# EAGLE design distribution (EAGLE 6.6.0)
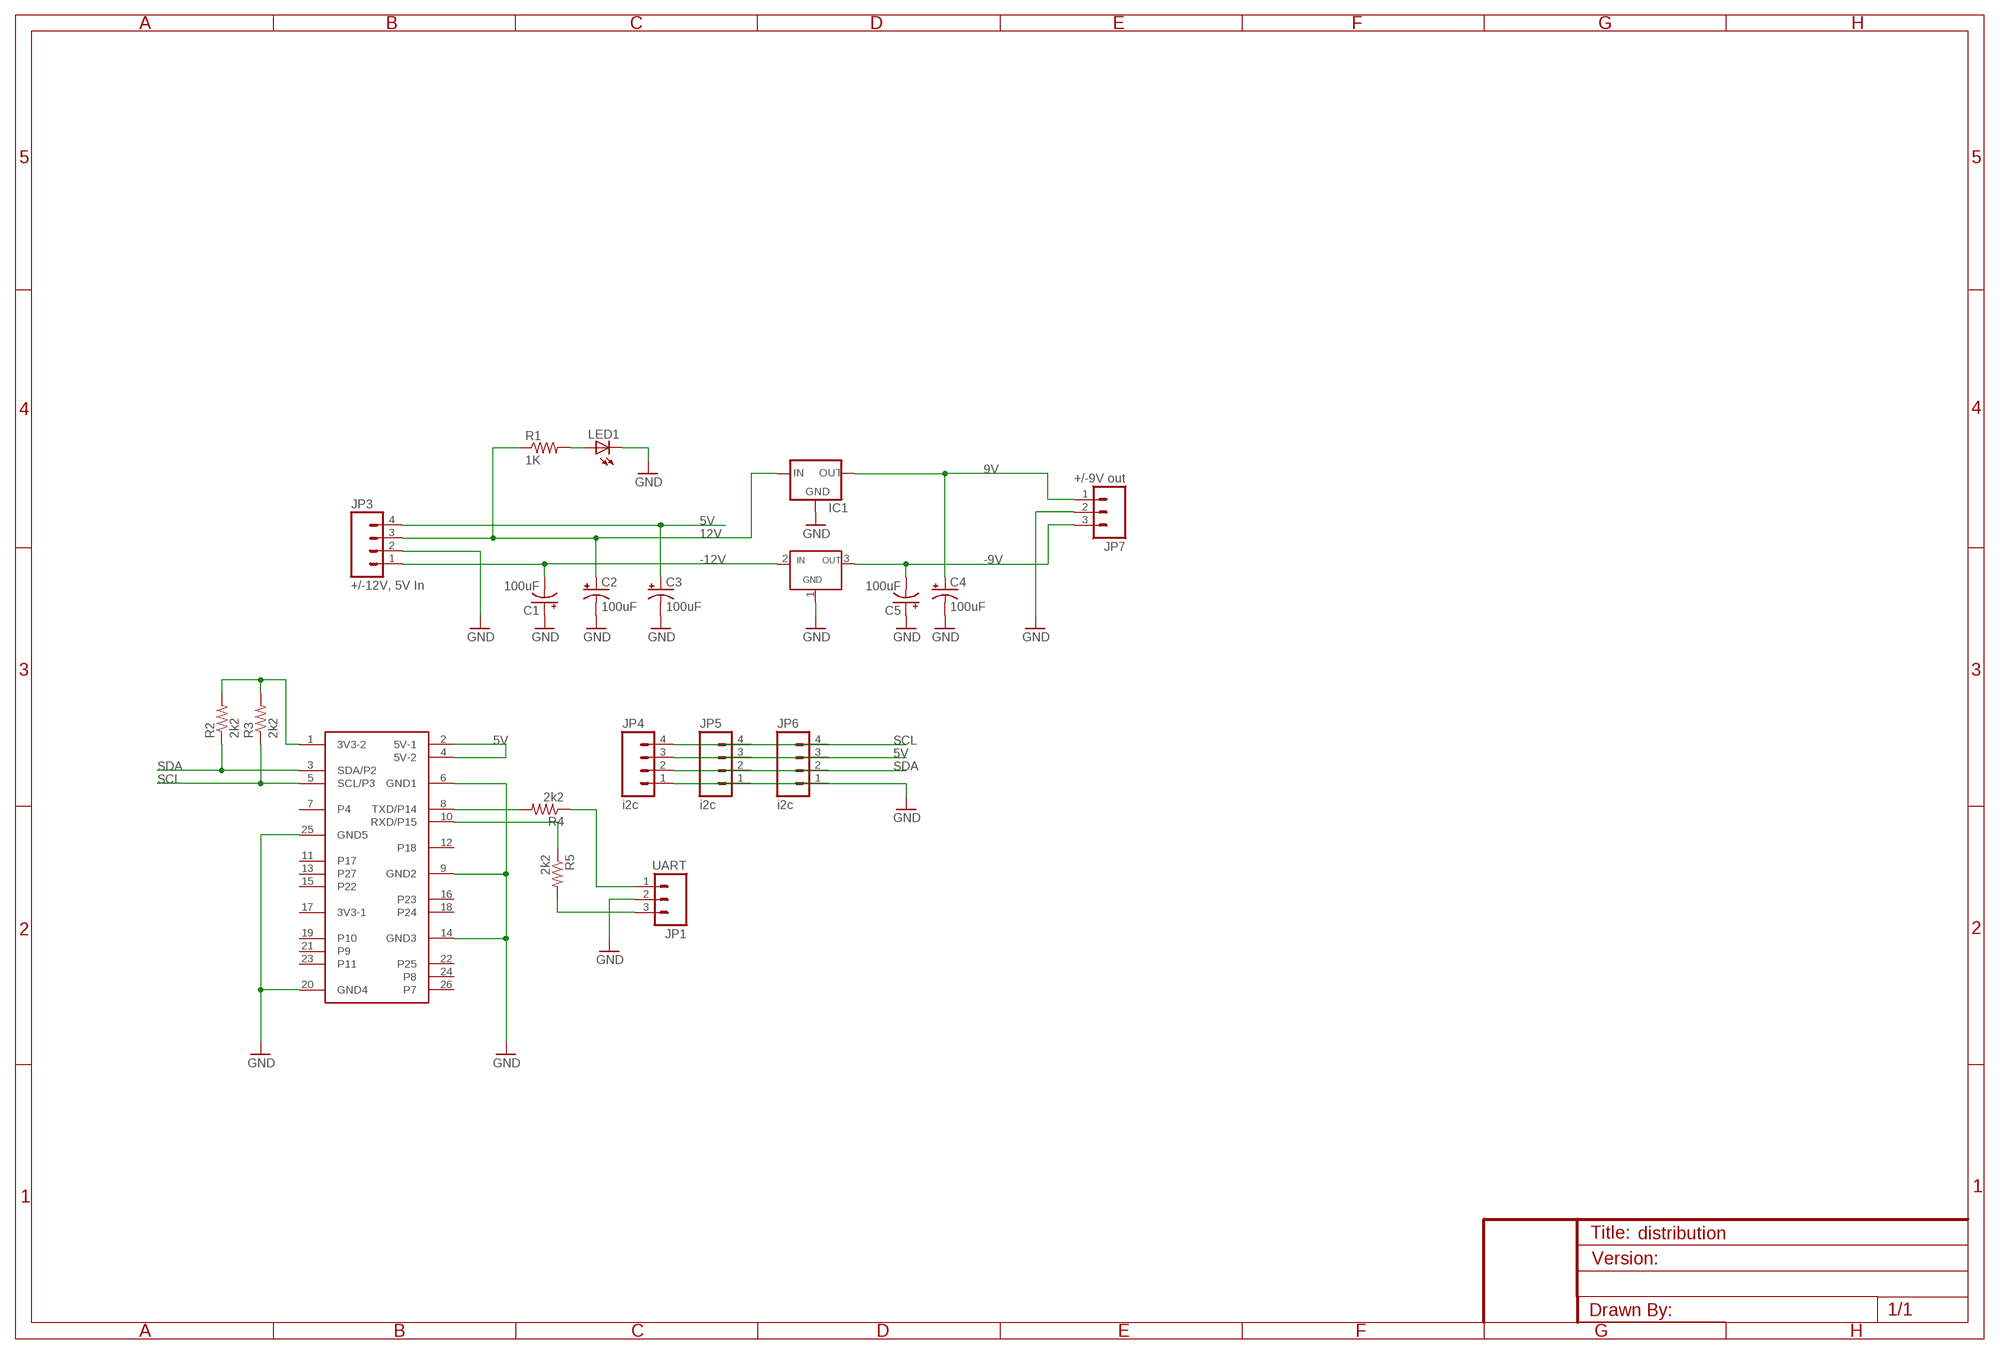
[diagram p0: schematic, sheet 1]

## Parts
C1  100uF  CAP_POLPTH1  [CPOL-RADIAL-100UF-25V]
C2  100uF  CAP_POLPTH1  [CPOL-RADIAL-100UF-25V]
C3  100uF  CAP_POLPTH1  [CPOL-RADIAL-100UF-25V]
C4  100uF  CAP_POLPTH1  [CPOL-RADIAL-100UF-25V]
C5  100uF  CAP_POLPTH1  [CPOL-RADIAL-100UF-25V]
IC1  78XXS  [78XXS]
JP1  UART  M03POLAR  [MOLEX-1X3]
JP3  +/-12V, 5V In  M04SCREW  [SCREWTERMINAL-3.5MM-4]
JP4  i2c  M04POLAR  [MOLEX-1X4]
JP5  i2c  M04POLAR  [MOLEX-1X4]
JP6  i2c  M04POLAR  [MOLEX-1X4]
JP7  +/-9V out  M03POLAR  [MOLEX-1X3]
LED1  LED1206  [LED-1206]
R1  1K  RESISTOR1206  [1206]
R2  2k2  RESISTOR1206  [1206]
R3  2k2  RESISTOR1206  [1206]
R4  2k2  RESISTOR1206  [1206]
R5  2k2  RESISTOR1206  [1206]
U$1  VREG-GIO  [TO-220V]
U$2  PI-GPIO  [M2X13]

## Nets
5V: C3.1(+) JP3.4 JP4.3 JP5.3 JP6.3 U$2.2(5V-1) U$2.4(5V-2)
9V: C4.1(+) IC1.OUT JP7.1
12V: C2.1(+) IC1.IN JP3.3 R1.1
-9V: C5.2(-) JP7.3 U$1.3(OUT)
-12V: C1.2(-) JP3.1 U$1.2(IN)
GND: C1.1(+) C2.2(-) C3.2(-) C4.2(-) C5.1(+) IC1.GND JP1.2 JP3.2 JP4.1 JP5.1 JP6.1 JP7.2 LED1.C U$1.1(GND) U$2.6(GND1) U$2.9(GND2) U$2.14(GND3) U$2.20(GND4) U$2.25(GND5)
N$1: LED1.A R1.2
N$2: R2.2 R3.2 U$2.1(3V3-2)
N$3: R4.2 U$2.8(TXD/P14)
N$4: R5.1 U$2.10(RXD/P15)
N$5: JP1.1 R4.1
N$6: JP1.3 R5.2
SCL: JP4.4 JP5.4 JP6.4 R3.1 U$2.5(SCL/P3)
SDA: JP4.2 JP5.2 JP6.2 R2.1 U$2.3(SDA/P2)
Unconnected: U$2.7(P4) U$2.11(P17) U$2.12(P18) U$2.13(P27) U$2.15(P22) U$2.16(P23) U$2.17(3V3-1) U$2.18(P24) U$2.19(P10) U$2.21(P9) U$2.22(P25) U$2.23(P11) U$2.24(P8) U$2.26(P7)

## Library data of the parts
C1-C5 = 1_SparkFun-Capacitors:CAP_POL: Capacitor Polarized These are standard SMD and PTH capacitors. Normally 10uF, 47uF, and 100uF in electrolytic and tantalum varieties. Always verify the external diameter of the through hole cap, it varies with capacity, voltage, and manufacturer. The EIA devices should be standard.
IC1 = v-reg:78XXS: VOLTAGE REGULATOR
JP1 JP7 = 1_SparkFun-Connectors:M03: Header 3 Standard 3-pin 0.1" header. Use with straight break away headers (SKU : PRT-00116), right angle break away headers (PRT-00553), swiss pins (PRT-00743), machine pins (PRT-00117), and female headers (PRT-00115). Molex polarized connector foot print use with SKU : PRT-08232 with associated crimp pins and housings.
JP3-JP6 = 1_SparkFun-Connectors:M04: Header 4 Standard 4-pin 0.1" header. Use with straight break away headers (SKU : PRT-00116), right angle break away headers (PRT-00553), swiss pins (PRT-00743), machine pins (PRT-00117), and female headers (PRT-00115). Molex polarized connector foot print use with SKU : PRT-08231 with associated crimp pins and housings. 1MM SMD Version SKU: PRT-10208
LED1 = 1_SparkFun-LED:LED: LEDs Standard schematic elements and footprints for 5mm, 3mm, 1206, and 0603 sized LEDs. 5mm - Spark Fun Electronics SKU : COM-00529 (and others)
R1-R5 = 1_SparkFun-Resistors:RESISTOR: Resistor Basic schematic elements and footprints for 0603, 1206, and PTH resistors.
U$1 = 0_Tristan's_Lib:VREG-GIO
U$2 = 0_Tristan's_Lib:PI-GPIO

## Board
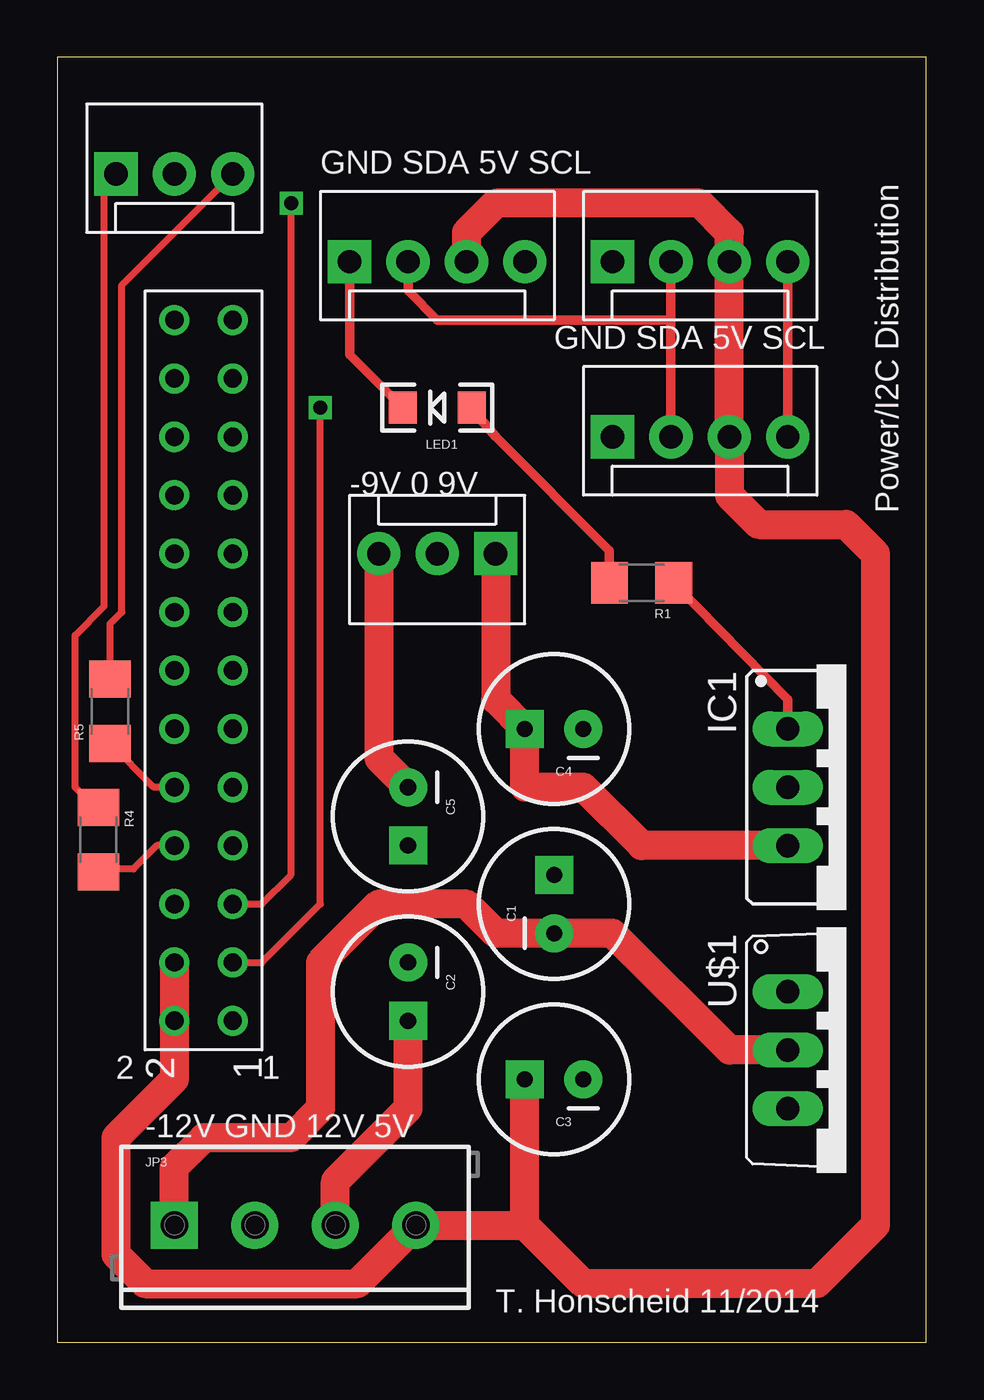
[diagram p1: board, top side]
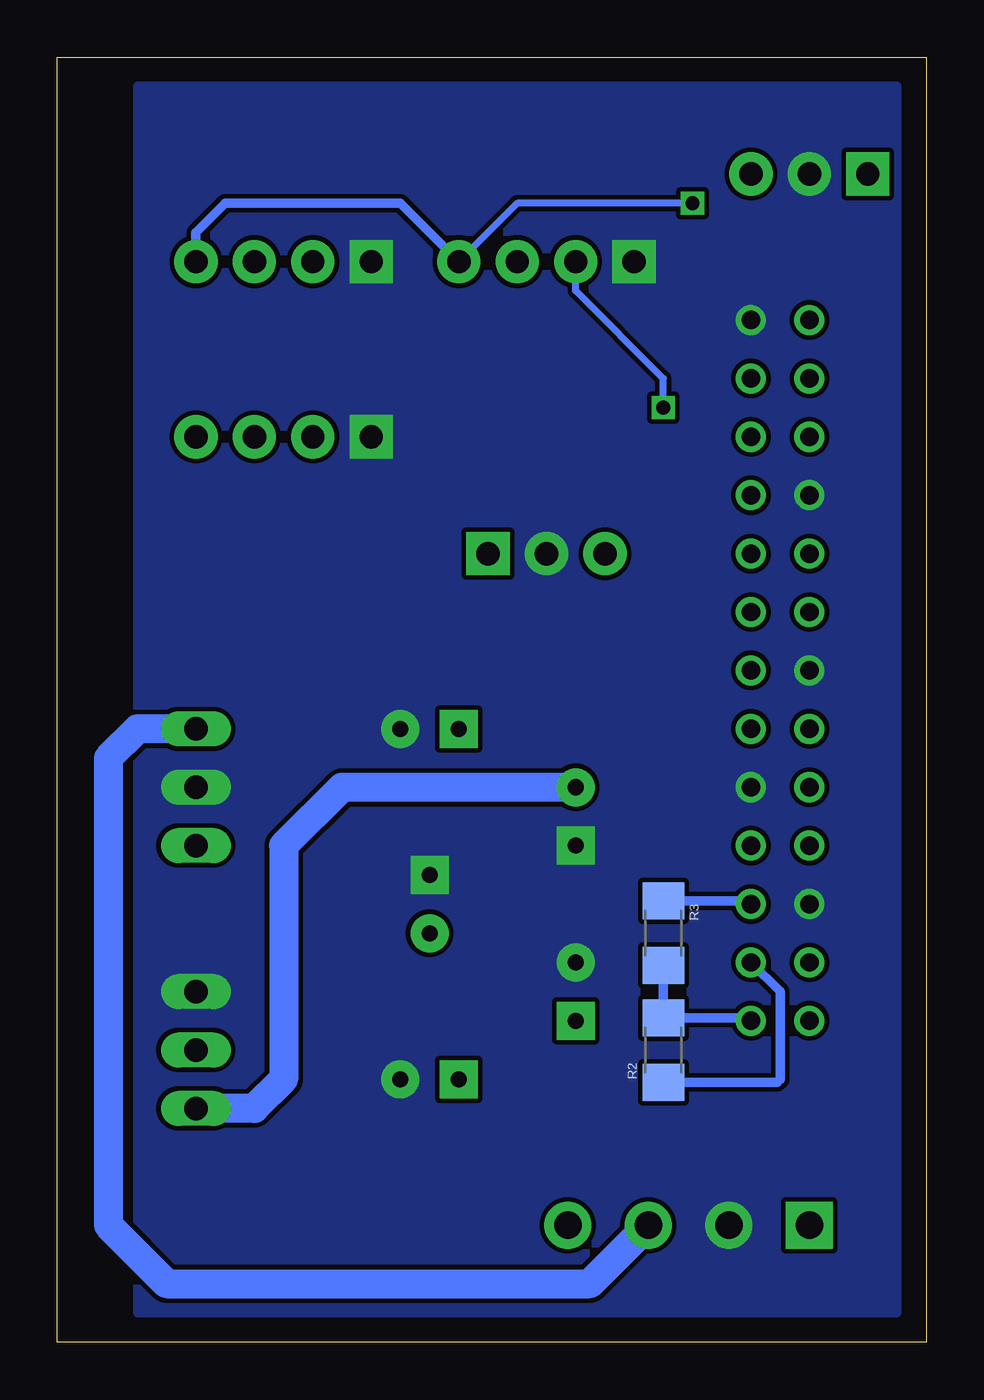
[diagram p2: board, bottom side, seen from below]

Size 37.77 x 55.87 mm. Coordinates in mm from the lower left corner, seen from the top.
Outline: 0,0 37.77,0 37.77,55.87 0,55.87 0,0
Copper layers (1*16): Top 0.035mm / dielectric 1.5mm / Bottom 0.035mm
Design rules "default": minimum track width 10mil, minimum drill 24mil, track to track 8mil, track to pad 8mil, pad to pad 8mil, via to via 8mil, smd to smd 8mil, copper to edge 40mil, drill to drill 8mil, minimum pad ring 10mil, minimum via ring 8mil, stop-mask expansion 4mil, vias tented up to drill 0mil, thermal gap 10mil

### Footprints (pad centres in the part's own frame; a part is rotated, then mirrored left to right if it is on the bottom)
CPOL-RADIAL-100UF-25V = drill 0.7 pad 1.651 square: 1 1.27,0 | drill 0.7 pad 1.651: 2 -1.27,0
78XXS = drill 1.016 long: GND 0,-2.54; IN -2.54,-2.54; OUT 2.54,-2.54
MOLEX-1X3 = drill 1.016 pad 1.88 square: 1 0,0 | drill 1.016 pad 1.88: 2 2.54,0; 3 5.08,0
SCREWTERMINAL-3.5MM-4 = drill 1.2 pad 2.032 square: 1 0,0 | drill 1.2 pad 2.032: 2 3.5,0; 3 7,0; 4 10.5,0
MOLEX-1X4 = drill 1.016 pad 1.88 square: 1 0,0 | drill 1.016 pad 1.88: 2 2.54,0; 3 5.08,0; 4 7.62,0
LED-1206 = smd 1.2 x 1.4: A -1.5,0; C 1.5,0
1206 = smd 1.6 x 1.8: 1 -1.4,0; 2 1.4,0
TO-220V = drill 1.016 long: 1 -2.54,0; 2 0,0; 3 2.54,0
M2X13 = drill 0.8: 1 0,-1.27; 2 0,1.27; 3 2.54,-1.27; 4 2.54,1.27; 5 5.08,-1.27; 6 5.08,1.27; 7 7.62,-1.27; 8 7.62,1.27; 9 10.16,-1.27; 10 10.16,1.27; 11 12.7,-1.27; 12 12.7,1.27; 13 15.24,-1.27; 14 15.24,1.27; 15 17.78,-1.27; 16 17.78,1.27; 17 20.32,-1.27; 18 20.32,1.27; 19 22.86,-1.27; 20 22.86,1.27; 21 25.4,-1.27; 22 25.4,1.27; 23 27.94,-1.27; 24 27.94,1.27; 25 30.48,-1.27; 26 30.48,1.27

### Placement (x,y rotation side)
C1  21.59,19.05 90 top
C2  15.24,15.24 270 top
C3  21.59,11.43 180 top
C4  21.59,26.67 180 top
C5  15.24,22.86 270 top
IC1  34.29,24.13 270 top
JP1  2.54,50.8 0 top
JP3  5.08,5.08 0 top
JP4  12.7,46.99 0 top
JP5  24.13,46.99 0 top
JP6  24.13,39.37 0 top
JP7  19.05,34.29 180 top
LED1  16.51,40.64 180 top
R1  25.4,33.02 180 top
R2  11.43,12.7 90 bottom
R3  11.43,17.78 270 bottom
R4  1.78,21.84 270 top
R5  2.29,27.43 90 top
U$1  31.75,12.7 270 top
U$2  6.35,13.97 90 top

### Tracks (layer width: path | path; a pad name or v marks a point on that pad's centre or on a via)
5V
  Top 1.27: JP4.3 17.78,48.26 19.05,49.53 27.94,49.53 29.21,48.26 JP5.3 JP6.3 29.21,36.83 30.48,35.56 34.29,35.56 35.56,34.29 35.56,5.08 33.02,2.54 22.86,2.54 20.32,5.08 | 20.32,5.08 JP3.4 13.04,2.54 3.81,2.54 2.54,3.81 2.54,8.89 5.08,11.43 U$2.2 U$2.4 | 20.32,5.08 C3.1
9V
  Top 1.27: JP7.1 19.05,27.94 C4.1 20.32,24.13 22.86,24.13 25.4,21.59 IC1.OUT
12V
  Top 0.406: IC1.IN 31.75,27.94 R1.1 26.67,33.02
  Top 1.27: JP3.3 12.08,7 15.24,10.16 C2.1
  Bottom 1.27: IC1.IN 34.29,26.67 35.56,25.4 35.56,5.08 33.02,2.54 14.62,2.54 JP3.3
-9V
  Top 1.27: JP7.3 13.97,25.4 C5.2
  Bottom 1.27: C5.2 25.4,24.13 27.94,21.59 27.94,11.43 29.21,10.16 U$1.3
-12V
  Top 1.27: U$1.2 29.21,12.7 24.13,17.78 C1.2 19.05,17.78 17.78,19.05 13.97,19.05 11.43,16.51 11.43,10.16 10.16,8.89 6.35,8.89 5.08,7.62 JP3.1
GND
  Top 0.406: JP4.1 12.7,42.95 LED1.C
  pour Bottom (no thermals): 1.27,1.27 34.29,1.27 34.29,54.61 1.27,54.61
N$1
  Top 0.406: R1.2 24,34.42 19.05,39.37 17.78,40.87 LED1.A
N$2
  Bottom 0.406: R3.2 R2.2 7.62,14.1 U$2.1
N$3
  Top 0.305: U$2.8 4.32,21.59 3.3,20.57 1.91,20.57 R4.2
N$4
  Top 0.305: U$2.10 4.19,24.13 R5.1
N$5
  Top 0.305: R4.1 1.65,23.24 0.76,24.13 0.76,30.73 2.03,32 2.03,50.29 JP1.1
N$6
  Top 0.305: R5.2 2.29,31.24 2.79,31.75 2.79,45.97 JP1.3
SCL  (via drill 0.6)
  Top 0.305: U$2.5 8.89,19.05 10.16,20.32 v10.16,49.53
  Top 0.406: JP6.4 JP5.4
  Bottom 0.305: v10.16,49.53 17.78,49.53 JP4.4
  Bottom 0.406: JP5.4 31.75,48.26 30.48,49.53 22.86,49.53 JP4.4 | R3.1 7.62,19.18 U$2.5
SDA  (via drill 0.6)
  Top 0.305: U$2.3 8.89,16.51 11.43,19.05 v11.43,40.64
  Top 0.406: JP6.2 26.67,44.45 | JP5.2 26.67,44.45 | 26.67,44.45 16.51,44.45 15.24,45.72 JP4.2
  Bottom 0.305: v11.43,40.64 11.43,41.91 15.24,45.72 JP4.2
  Bottom 0.406: R2.1 6.48,11.3 6.35,11.43 6.35,15.24 U$2.3

### Text on the board
tPlace: GND SDA 5V SCL | GND SDA 5V SCL | -9V 0 9V | Power/I2C Distribution | 2 | 1 | -12V GND 12V 5V | T. Honscheid 11/2014